# EAGLE design workshop_pcb (EAGLE 9.6.2)
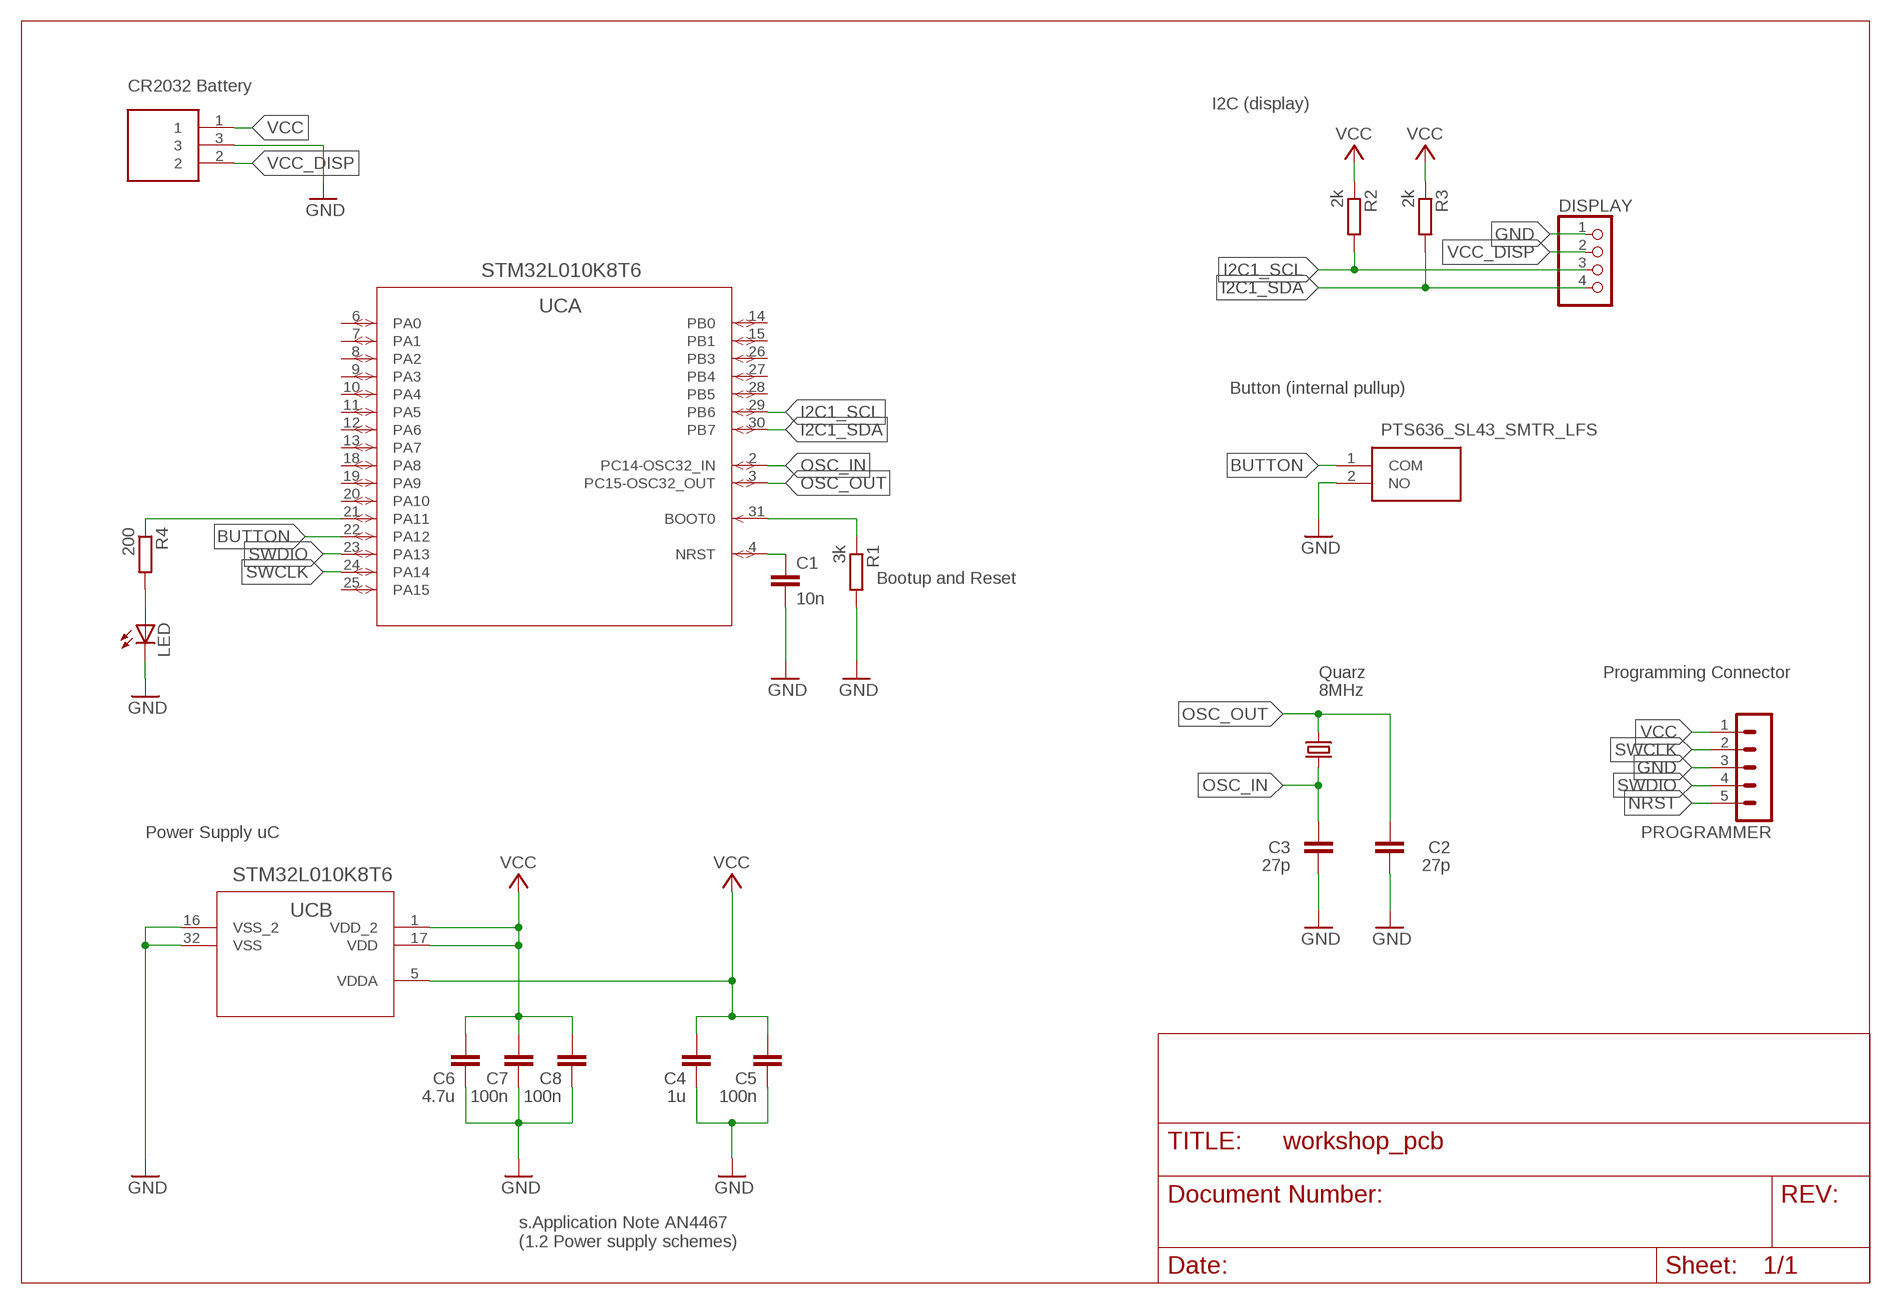
[diagram p0: schematic, sheet 1]

## Parts
BUTTON  PTS636_SL43_SMTR_LFS  [PTS636SL43SMTRLFS]
C1  10n  C-EUC0805  [C0805]
C2  27p  C-EUC0805  [C0805]
C3  27p  C-EUC0805  [C0805]
C4  1u  C-EUC0805  [C0805]
C5  100n  C-EUC0805  [C0805]
C6  4.7u  C-EUC0805  [C0805]
C7  100n  C-EUC0805  [C0805]
C8  100n  C-EUC0805  [C0805]
CR2032  BAT-HLD-001  [BATHLD001]
DISPLAY  PINHD-1X4  [1X04]
LED  LEDCHIPLED_0805  [CHIPLED_0805]
PROGRAMMER  MA05-1  [MA05-1]
QUARZ  8MHz  CRYSTALHC49S  [HC49/S]
R1  3k  R-EU_R0805  [R0805]
R2  2k  R-EU_R0805  [R0805]
R3  2k  R-EU_R0805  [R0805]
R4  200  R-EU_R0805  [R0805]
UC  STM32L010K8T6  [LQFP32_7X7X1P4]

## Nets
BOOT0: R1.1 UC.31(A:BOOT0)
BUTTON: BUTTON.1(COM) UC.22(A:PA12)
GND: BUTTON.2(NO) C1.2 C2.1 C3.1 C4.1 C5.1 C6.1 C7.1 C8.1 CR2032.3 DISPLAY.1 LED.C PROGRAMMER.3 R1.2 UC.16(B:VSS_2) UC.32(B:VSS)
I2C1_SCL: DISPLAY.3 R2.2 UC.29(A:PB6)
I2C1_SDA: DISPLAY.4 R3.2 UC.30(A:PB7)
N$2: LED.A R4.2
N$4: R4.1 UC.21(A:PA11)
NRST: C1.1 PROGRAMMER.5 UC.4(A:NRST)
OSC_IN: C3.2 QUARZ.2 UC.2(A:PC14-OSC32_IN)
OSC_OUT: C2.2 QUARZ.1 UC.3(A:PC15-OSC32_OUT)
SWCLK: PROGRAMMER.2 UC.24(A:PA14)
SWDIO: PROGRAMMER.4 UC.23(A:PA13)
VCC: C4.2 C5.2 C6.2 C7.2 C8.2 CR2032.1 PROGRAMMER.1 R2.1 R3.1 UC.1(B:VDD_2) UC.5(B:VDDA) UC.17(B:VDD)
VCC_DISP: CR2032.2 DISPLAY.2
Unconnected: UC.6(A:PA0) UC.7(A:PA1) UC.8(A:PA2) UC.9(A:PA3) UC.10(A:PA4) UC.11(A:PA5) UC.12(A:PA6) UC.13(A:PA7) UC.14(A:PB0) UC.15(A:PB1) UC.18(A:PA8) UC.19(A:PA9) UC.20(A:PA10) UC.25(A:PA15) UC.26(A:PB3) UC.27(A:PB4) UC.28(A:PB5)

## Notes on the sheet
- CR2032 Battery
- I2C (display)
- Button (internal pullup)
- Bootup and Reset
- Quarz | Programming Connector
- Power Supply uC
- s.Application Note AN4467
  (1.2 Power supply schemes)

## Library data of the parts
BUTTON = SamacSys_Parts:PTS636_SL43_SMTR_LFS: Tactile Switches Tact 50mA 12VDC, 6.0x3.5, 4.3mm H, 130gf, G leads, No ground pin, Black Actuator Source: Datasheet; DESCRIPTION: Tactile Switches Tact 50mA 12VDC, 6.0x3.5, 4.3mm H, 130gf, G leads, No ground pin, Black Actuator; HEIGHT: 4.5mm; MANUFACTURER_NAME: C & K COMPONENTS; MANUFACTURER_PART_NUMBER: PTS636 SL43 SMTR LFS; MOUSER_PART_NUMBER: 611-PTS636SL43SMTRLF; MOUSER_PRICE-STOCK: https://www.mouser.co.uk/ProductDetail/CK/PTS636-SL43-SMTR-LFS?qs=vLWxofP3U2x0maTON%2FqK1g%3D%3D
C1-C8 = rcl:C-EU: CAPACITOR, European symbol; SPICEPREFIX: C
CR2032 = SamacSys_Parts:BAT-HLD-001: Coin Cell Battery Holders Linx CR2032 Battery Holder Source: Datasheet; DESCRIPTION: Coin Cell Battery Holders Linx CR2032 Battery Holder; HEIGHT: 4mm; MANUFACTURER_NAME: Linx Technologies; MANUFACTURER_PART_NUMBER: BAT-HLD-001; MOUSER_PART_NUMBER: 712-BAT-HLD-001; MOUSER_PRICE-STOCK: https://www.mouser.co.uk/ProductDetail/Linx-Technologies/BAT-HLD-001?qs=K5ta8V%252BWhta7hbVGfm4dqA%3D%3D
DISPLAY = pinhead:PINHD-1X4: PIN HEADER
LED = led:LED: LED OSRAM: - CHIPLED LG R971, LG N971, LY N971, LG Q971, LY Q971, LO R971, LY R971 LH N974, LH R974 LS Q976, LO Q976, LY Q976 LO Q996 - Hyper CHIPLED LW Q18S LB Q993, LB Q99A, LB R99A - SideLED LS A670, LO A670, LY A670, LG A670, LP A670 LB A673, LV A673, LT A673, LW A673 LH A674 LY A675 LS A676, LA A676, LO A676, LY A676, LW A676 LS A679, LY A679, LG A679 - Hyper Micro SIDELED® LS Y876, LA Y876, LO Y876, LY Y876 LT Y87S - SmartLED LW L88C, LW L88S LB L89C, LB L89S, LG L890 LS L89K, LO L89K, LY L89K LS L896, LA L896, LO L896, LY L896 - TOPLED LS T670, LO T670, LY T670, LG T670, LP T670 LSG T670, LSP T670, LSY T670, LOP T670, LYG T670 LG T671, LOG T671, LSG T671 LB T673, LV T673, LT T673, LW T673 LH T674 LS T676, LA T676, LO T676, LY T676, LB T676, LH T676, LSB T676, LW T676 LB T67C, LV T67C, LT T67C, LS T67K, LO T67K, LY T67K, LW E67C LS E67B, LA E67B, LO E67B, LY E67B, LB E67C, LV E67C, LT E67C LW T67C LS T679, LY T679, LG T679 LS T770, LO T770, LY T770, LG T770, LP T770 LB T773, LV T773, LT T773, LW T773 LH T774 LS E675, LA E675, LY E675, LS T675 LS T776, LA T776, LO T776, LY T776, LB T776 LHGB T686 LT T68C, LB T68C - Hyper Mini TOPLED® LB M676 - Mini TOPLED Santana® LG M470 LS M47K, LO M47K, LY M47K Source: http://www.osram.convergy.de LUXEON: - LUMILED® LXK2-PW12-R00, LXK2-PW12-S00, LXK2-PW14-U00, LXK2-PW14-V00 LXK2-PM12-R00, LXK2-PM12-S00, LXK2-PM14-U00 LXK2-PE12-Q00, LXK2-PE12-R00, LXK2-PE12-S00, LXK2-PE14-T00, LXK2-PE14-U00 LXK2-PB12-K00, LXK2-PB12-L00, LXK2-PB12-M00, LXK2-PB14-N00, LXK2-PB14-P00, LXK2-PB14-Q00 LXK2-PR12-L00, LXK2-PR12-M00, LXK2-PR14-Q00, LXK2-PR14-R00 LXK2-PD12-Q00, LXK2-PD12-R00, LXK2-PD12-S00 LXK2-PH12-R00, LXK2-PH12-S00 LXK2-PL12-P00, LXK2-PL12-Q00, LXK2-PL12-R00 Source: www.luxeon.com KINGBRIGHT: KA-3528ASYC Source: www.kingbright.com
PROGRAMMER = con-lstb:MA05-1: PIN HEADER; OC_FARNELL: unknown; OC_NEWARK: unknown
QUARZ = crystal:CRYSTAL: CRYSTAL; OC_FARNELL: 1667008; OC_NEWARK: unknown
R1-R4 = rcl:R-EU_: RESISTOR, European symbol; SPICEPREFIX: R
UC = STM32L010K8T6:STM32L010K8T6; BUILT_BY: EMA_UL_Team; COPYRIGHT: Copyright (C) 2018 Accelerated Designs. All rights reserved; MANUFACTURER_PART_NUMBER: STM32L010K8T6; SOURCELIBRARY: Updates_to_database_2020-10-19; VENDOR: STMicroelectronics

## Board
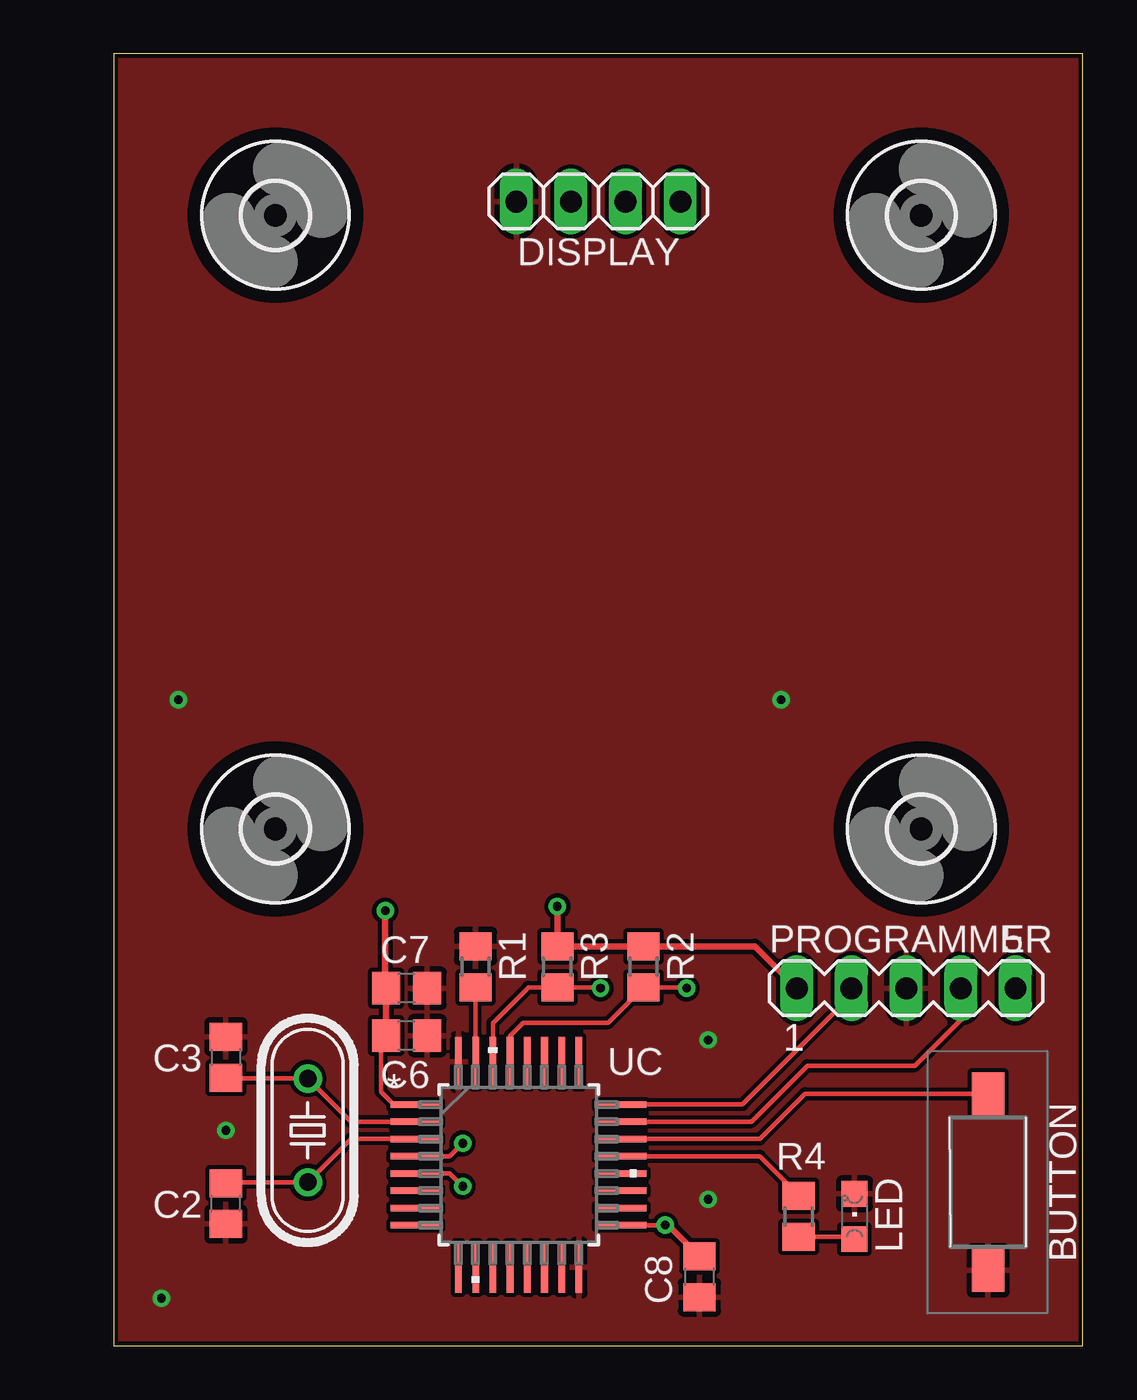
[diagram p1: board, top side]
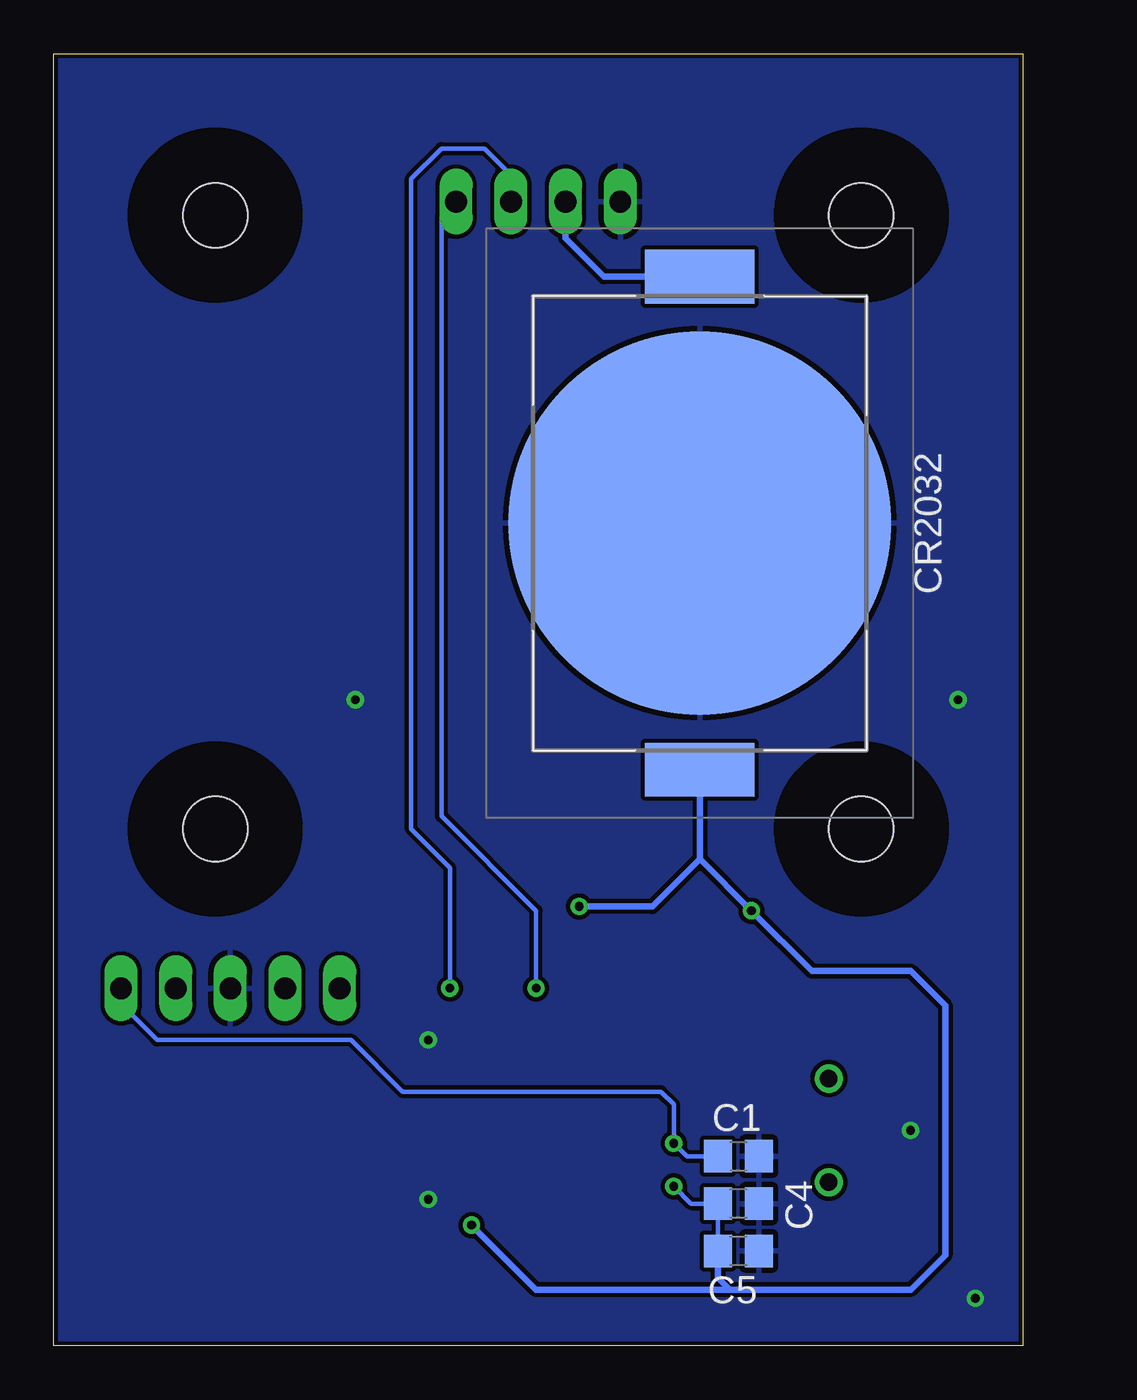
[diagram p2: board, bottom side, seen from below]

Size 45 x 60 mm. Coordinates in mm from the lower left corner, seen from the top.
Outline: 0,0 45,0 45,60 0,60 0,0
Copper layers (1*16): Top 0.035mm / dielectric 1.5mm / Bottom 0.035mm
Design rules "default *": minimum track width 0.2mm, minimum drill 0.4mm, track to track 0.2mm, track to pad 0.2mm, pad to pad 0.2mm, via to via 0.2mm, smd to smd 0.2mm, copper to edge 0.2mm, drill to drill 0.2mm, minimum pad ring 10mil, minimum via ring 8mil, stop-mask expansion 4mil, vias tented up to drill 0mil, thermal gap 10mil

### Footprints (pad centres in the part's own frame; a part is rotated, then mirrored left to right if it is on the bottom)
PTS636SL43SMTRLFS = smd 2 x 1.5: 1 -4.1,0; 2 4.1,0
C0805 = smd 1.3 x 1.5: 1 -0.95,0; 2 0.95,0
BATHLD001 = smd 2.5 x 5.1: 1 11.45,0; 2 -11.45,0 | smd 17.8 x 17.8: 3 0,0
1X04 = drill 1.016 long: 1 -3.81,0; 2 -1.27,0; 3 1.27,0; 4 3.81,0
CHIPLED_0805 = smd 1.2 x 1.2: A 0,-1.05; C 0,1.05
MA05-1 = drill 1.016 long: 1 -5.08,0; 2 -2.54,0; 3 0,0; 4 2.54,0; 5 5.08,0
HC49/S = drill 0.813: 1 -2.413,0; 2 2.413,0
R0805 = smd 1.3 x 1.5: 1 -0.95,0; 2 0.95,0
3,0 = hole 3: 0,0
LQFP32_7X7X1P4 = smd 2.353 x 0.304: 1 -4.771,2.8; 2 -4.771,2; 3 -4.771,1.2; 4 -4.771,0.4; 5 -4.771,-0.4; 6 -4.771,-1.2; 7 -4.771,-2; 8 -4.771,-2.8; 17 4.771,-2.8; 18 4.771,-2; 19 4.771,-1.2; 20 4.771,-0.4; 21 4.771,0.4; 22 4.771,1.2; 23 4.771,2; 24 4.771,2.8 | smd 0.304 x 2.353: 9 -2.8,-4.771; 10 -2,-4.771; 11 -1.2,-4.771; 12 -0.4,-4.771; 13 0.4,-4.771; 14 1.2,-4.771; 15 2,-4.771; 16 2.8,-4.771; 25 2.8,4.771; 26 2,4.771; 27 1.2,4.771; 28 0.4,4.771; 29 -0.4,4.771; 30 -1.2,4.771; 31 -2,4.771; 32 -2.8,4.771

### Placement (x,y rotation side)
BUTTON  40.6,7.6 270 top
C1  13.2,8.8 0 bottom
C2  5.2,6.6 90 top
C3  5.2,13.4 270 top
C4  13.2,6.6 180 bottom
C5  13.2,4.4 180 bottom
C6  13.6,14.4 180 top
C7  13.6,16.6 180 top
C8  27.2,3.2 90 top
CR2032  15,38.2 270 bottom
DISPLAY  22.5,53.14 0 top
LED  34.4,6 0 top
PROGRAMMER  36.8,16.6 0 top
QUARZ  9,10 90 top
R1  16.8,17.6 90 top
R2  24.6,17.6 270 top
R3  20.6,17.6 270 top
R4  31.8,6 270 top
U$1  [3,0]  7.5,52.5 0 top
U$2  [3,0]  37.5,52.5 0 top
U$3  [3,0]  7.5,24 0 top
U$4  [3,0]  37.5,24 0 top
UC  18.8,8.4 0 top

### Tracks (layer width: path | path; a pad name or v marks a point on that pad's centre or on a via)
BOOT0
  Top 0.2: UC.31 R1.1
BUTTON
  Top 0.2: UC.22 30,9.6 32.1,11.7 BUTTON.1
GND  (via drill 0.4)
  other vias: 31,30 3,30 2.2,2.2 27.6,6.8 27.6,14.2 5.2,10
  pour Top: -1,61 46,61 46,-1 -1,-1
  pour Bottom: -1.6,61.6 46.6,61.6 46.6,60.6 46.6,-1.8 1.2,-1.8 -1.6,-1.8
I2C1_SCL  (via drill 0.4)
  Top 0.2: UC.29 18.4,14.4 19,15 22.95,15 R2.2 26.55,16.65 v26.6,16.6
  Bottom 0.2: DISPLAY.3 23.77,54.37 25,55.6 27,55.6 28.4,54.2 28.4,24 26.6,22.2 v26.6,16.6
I2C1_SDA  (via drill 0.4)
  Top 0.2: UC.30 17.6,15 19.25,16.65 R3.2 22.55,16.65 v22.6,16.6
  Bottom 0.2: DISPLAY.4 27,52.45 27,24.6 22.6,20.2 v22.6,16.6
N$2
  Top 0.2: R4.2 34.3,5.05 LED.A
N$4
  Top 0.2: UC.21 30,8.8 31.8,7 R4.1
NRST  (via drill 0.4)
  Top 0.2: UC.4 15.6,8.8 v16.2,9.4
  Bottom 0.2: PROGRAMMER.5 41.88,15.88 40.2,14.2 31.2,14.2 28.8,11.8 16.8,11.8 16.2,11.2 v16.2,9.4 15.6,8.8 C1.1
OSC_IN
  Top 0.2: UC.2 11.01,10.4 QUARZ.2 5.24,12.41 C3.2
OSC_OUT
  Top 0.2: UC.3 11.01,9.6 QUARZ.1 5.24,7.59 C2.2
SWCLK
  Top 0.2: UC.24 29.2,11.2 34.26,16.26 PROGRAMMER.2
SWDIO
  Top 0.2: UC.23 29.6,10.4 32.2,13 37.2,13 39.34,15.14 PROGRAMMER.4
VCC  (via drill 0.4)
  Top 0.2: UC.1 13,11.2 12.4,11.8 12.4,14.15 C6.2 | UC.17 v25.6,5.6 | UC.5 15.6,8 v16.2,7.4
  Top 0.3: v20.6,20.4 R3.1 R2.1 29.77,18.55 PROGRAMMER.1 | v12.6,20.2 12.6,16.65 C7.2 C6.2 | v25.6,5.6 25.75,5.6 C8.2
  Bottom 0.2: C5.2 C4.2 15.4,6.6 v16.2,7.4
  Bottom 0.3: CR2032.1 15,22.6 | v20.6,20.4 17.2,20.4 15,22.6 | 15,22.6 v12.6,20.2 9.8,17.4 5.2,17.4 3.6,15.8 3.6,4.2 5.2,2.6 13.6,2.6 | C5.2 14.15,3.15 13.6,2.6 | 13.6,2.6 22.6,2.6 v25.6,5.6
VCC_DISP
  Bottom 0.3: DISPLAY.2 21.23,51.43 19.45,49.65 CR2032.2